# EAGLE design tick-ds3231-breakout-mk-2.0 (EAGLE 6.5.0)
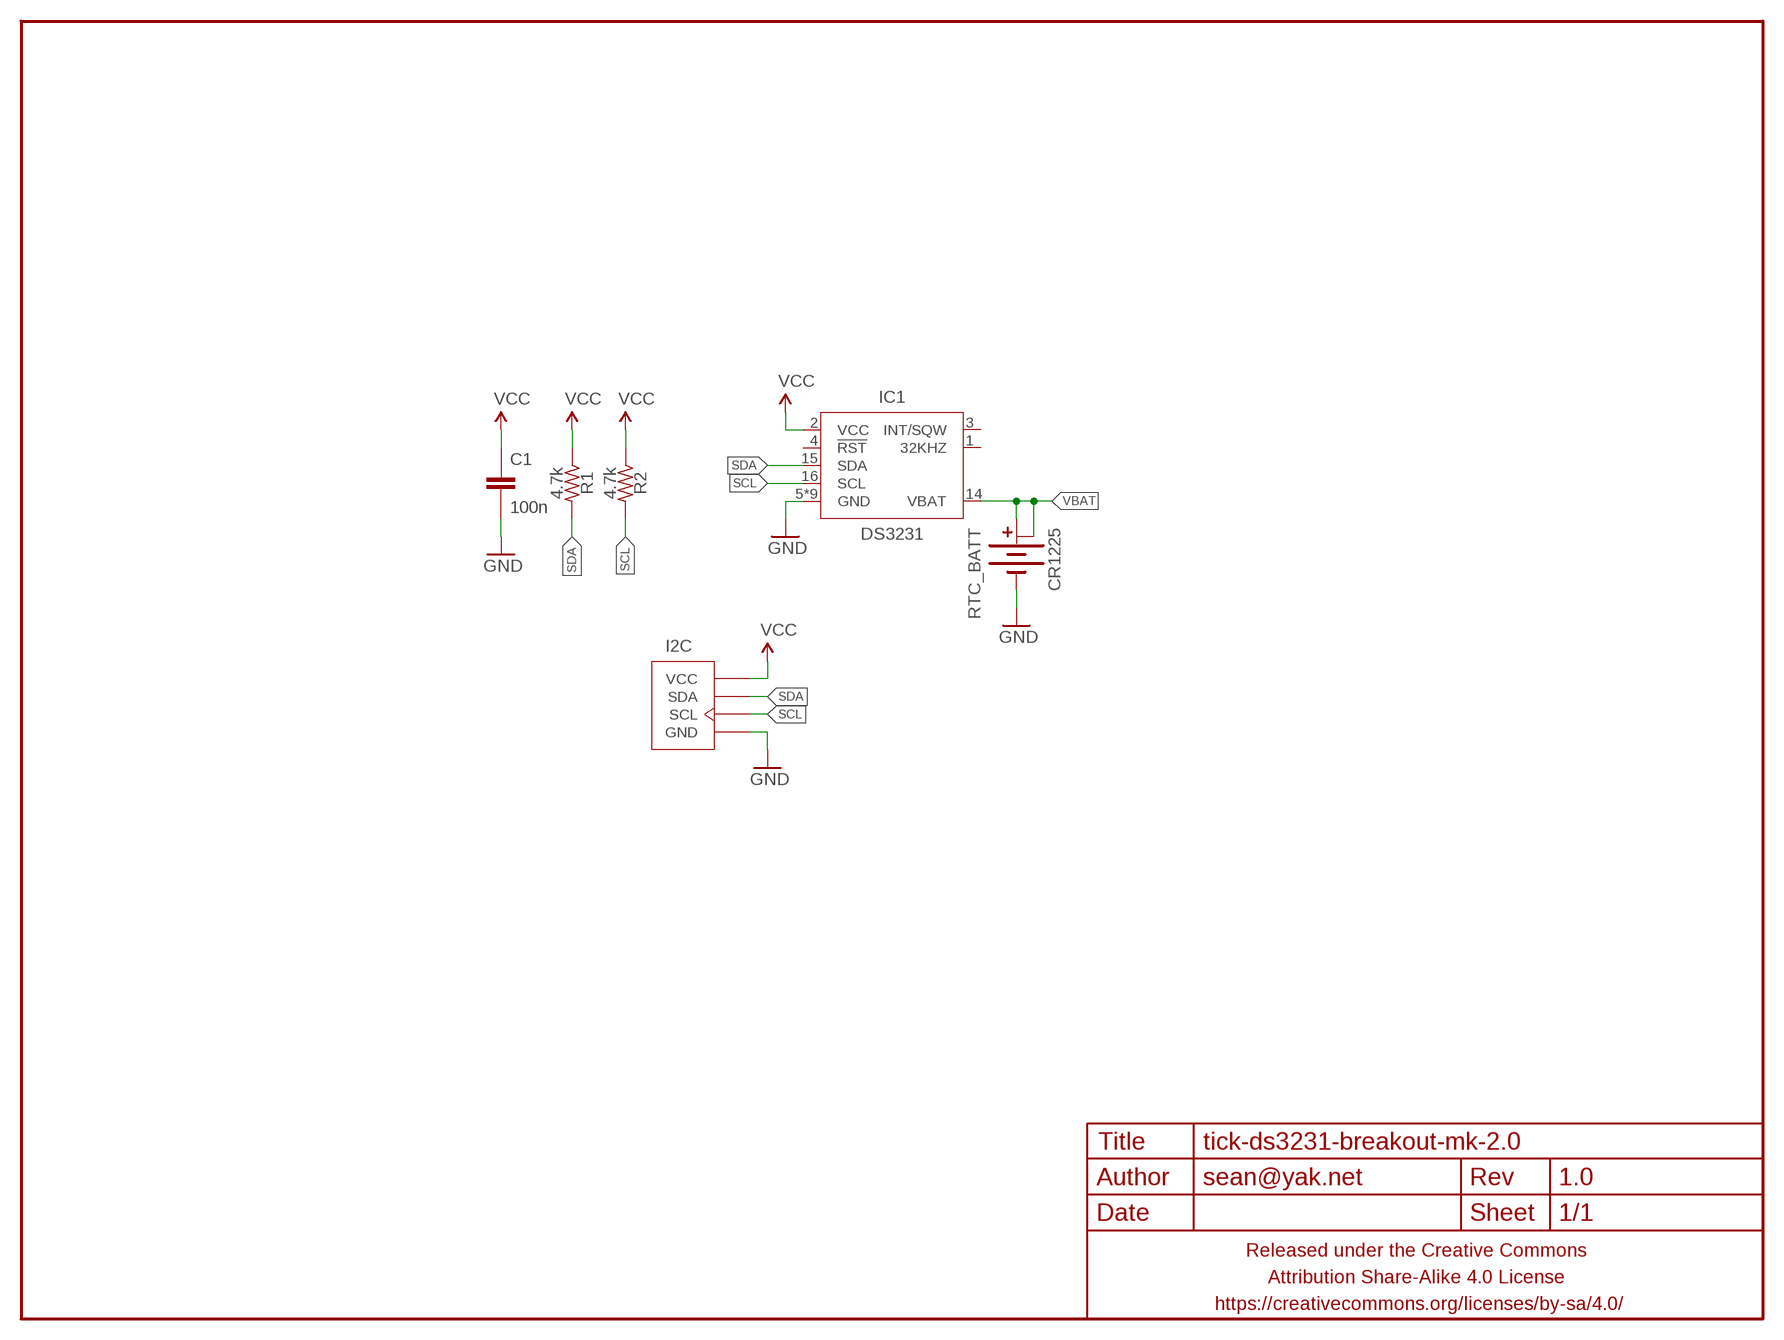
[diagram p0: schematic, sheet 1]

## Parts
C1  100n  CAPACITOR-CERAMICC0805  [C0805]
FRAME1  FRAME-LETTERNO_PACKAGE  [DUMMY]
I2C  M04-I2CPTH-0.1IN-CENTERED  [1X04-PTH-VERT-I2C-CENTERED]
IC1  DS3231  [SO16W]
R1  4.7k  RESISTORR0805  [R0805]
R2  4.7k  RESISTORR0805  [R0805]
RTC_BATT  CR1225  BATTERY-COINCR1225_SMD_SMALLER  [BATTCON_12MM_SMD]

## Nets
GND: C1.2 I2C.GND IC1.5(GND) IC1.6(GND) IC1.7(GND) IC1.8(GND) IC1.9(GND) IC1.10(GND) IC1.11(GND) IC1.12(GND) IC1.13(GND) RTC_BATT.-
SCL: I2C.SCL IC1.16(SCL) R2.2
SDA: I2C.SDA IC1.15(SDA) R1.2
VBAT: IC1.14(VBAT) RTC_BATT.+@1(+) RTC_BATT.+@2(+1)
VCC: C1.1 I2C.VCC IC1.2(VCC) R1.1 R2.1
Unconnected: IC1.1(32KHZ) IC1.3(INT/SQW) IC1.4(!RST)

## Library data of the parts
C1 = A_butts:CAPACITOR-CERAMIC: CAPACITOR, European symbol
FRAME1 = A_butts:FRAME-LETTER: Schematic Frame Standard 8.5x11 US Letter frame; DESIGNER: sean@yak.net; VERSION: 1.0
I2C = A_butts:M04-I2C
IC1 = A_butts:DS3231
R1 R2 = A_butts:RESISTOR: RESISTOR, American symbol
RTC_BATT = A_butts:BATTERY-COIN

## Board
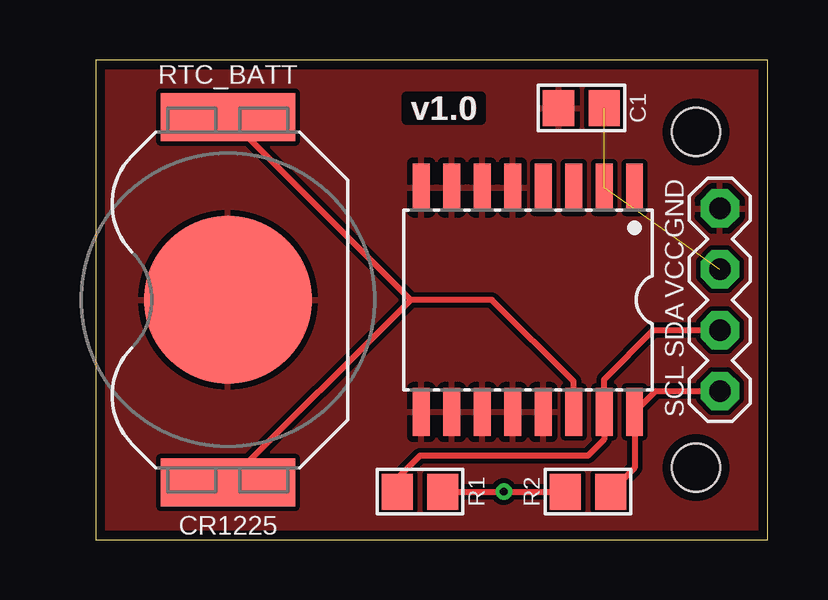
[diagram p1: board, top side]
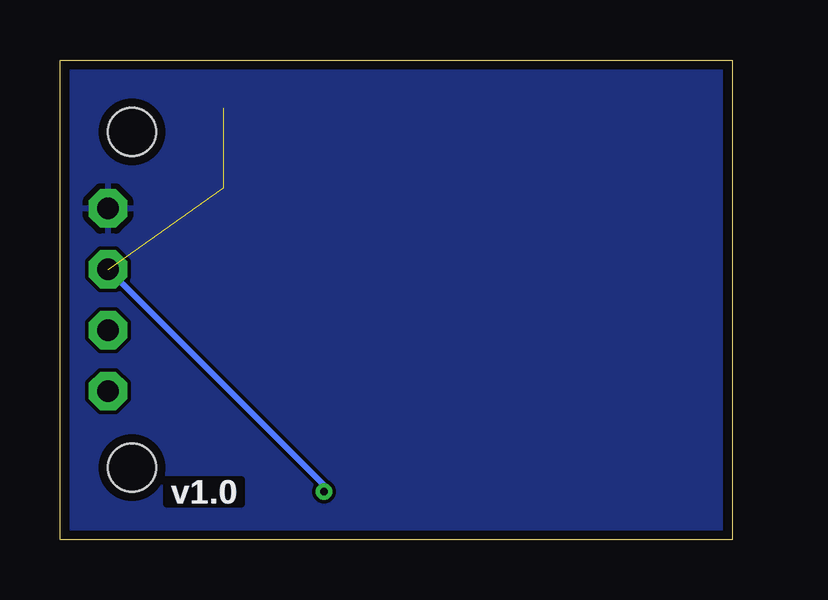
[diagram p2: board, bottom side, seen from below]

Size 28 x 20 mm. Coordinates in mm from the lower left corner, seen from the top.
Outline: 0,20 0,0 28,0 28,20 0,20
Copper layers (1*16): Top 0.0356mm / dielectric 1.5011mm / Bottom 0.0356mm
Design rules "LaenPCBOrder_2": minimum track width 6mil, minimum drill 13mil, track to track 6mil, track to pad 6mil, pad to pad 6mil, via to via 6mil, smd to smd 6mil, copper to edge 15mil, drill to drill 6mil, minimum pad ring 7mil, minimum via ring 7mil, stop-mask expansion 3mil, vias tented up to drill 20mil, thermal gap 10mil
Holes 2 mm at 25,3 25,17

### Footprints (pad centres in the part's own frame; a part is rotated, then mirrored left to right if it is on the bottom)
C0805 = smd 1.3 x 1.5: 1 -0.95,0; 2 0.95,0
1X04-PTH-VERT-I2C-CENTERED = drill 0.9 pad 1.6 octagon: GND -3.81,0; SCL 3.81,0; SDA 1.27,0; VCC -1.27,0
SO16W = smd 0.7 x 2: 1 -4.445,-4.685; 2 -3.175,-4.685; 3 -1.905,-4.685; 4 -0.635,-4.685; 5 0.635,-4.685; 6 1.905,-4.685; 7 3.175,-4.685; 8 4.445,-4.685; 9 4.445,4.685; 10 3.175,4.685; 11 1.905,4.685; 12 0.635,4.685; 13 -0.635,4.685; 14 -1.905,4.685; 15 -3.175,4.685; 16 -4.445,4.685
R0805 = smd 1.3 x 1.5: 1 -0.95,0; 2 0.95,0
BATTCON_12MM_SMD = smd 2 x 5.6: +@1 -7.62,0; +@2 7.62,0 | smd 7 x 7: - 0,0

### Placement (x,y rotation side)
C1  20.23,18 180 top
FRAME1  0,-0.5 0 top
I2C  26,10 270 top
IC1  18,10 180 top
R1  13.5,2 180 top
R2  20.5,2 0 top
RTC_BATT  5.5,10 270 top

### Tracks (layer width: path | path; a pad name or v marks a point on that pad's centre or on a via)
GND
  pour Top (isolate 0.2): 28,20 28,0 0,0 0,20
  pour Bottom: 0,0 0,20 28,20 28,0
SCL
  Top 0.25: I2C.SCL 23.32,6.19 IC1.16 22.45,3 R2.2
SDA
  Top 0.25: R1.2 12.55,2.55 13.5,3.5 20.5,3.5 21.18,4.17 IC1.15 21.18,6.67 23.23,8.73 I2C.SDA
VBAT
  Top 0.25: RTC_BATT.+@1 13.12,10 | RTC_BATT.+@2 13.12,10 | IC1.14 19.91,6.59 16.5,10 13.12,10
VCC  (via drill 0.33)  (2 unrouted)
  Top 0.25: R1.1 v17,2 R2.1
  Bottom 0.25: I2C.VCC 17,2.27 v17,2